# Altium schematic sheet Display-RTC.SchDoc
size 431 x 279 mm; SheetNumber: 2; SheetTotal: 2
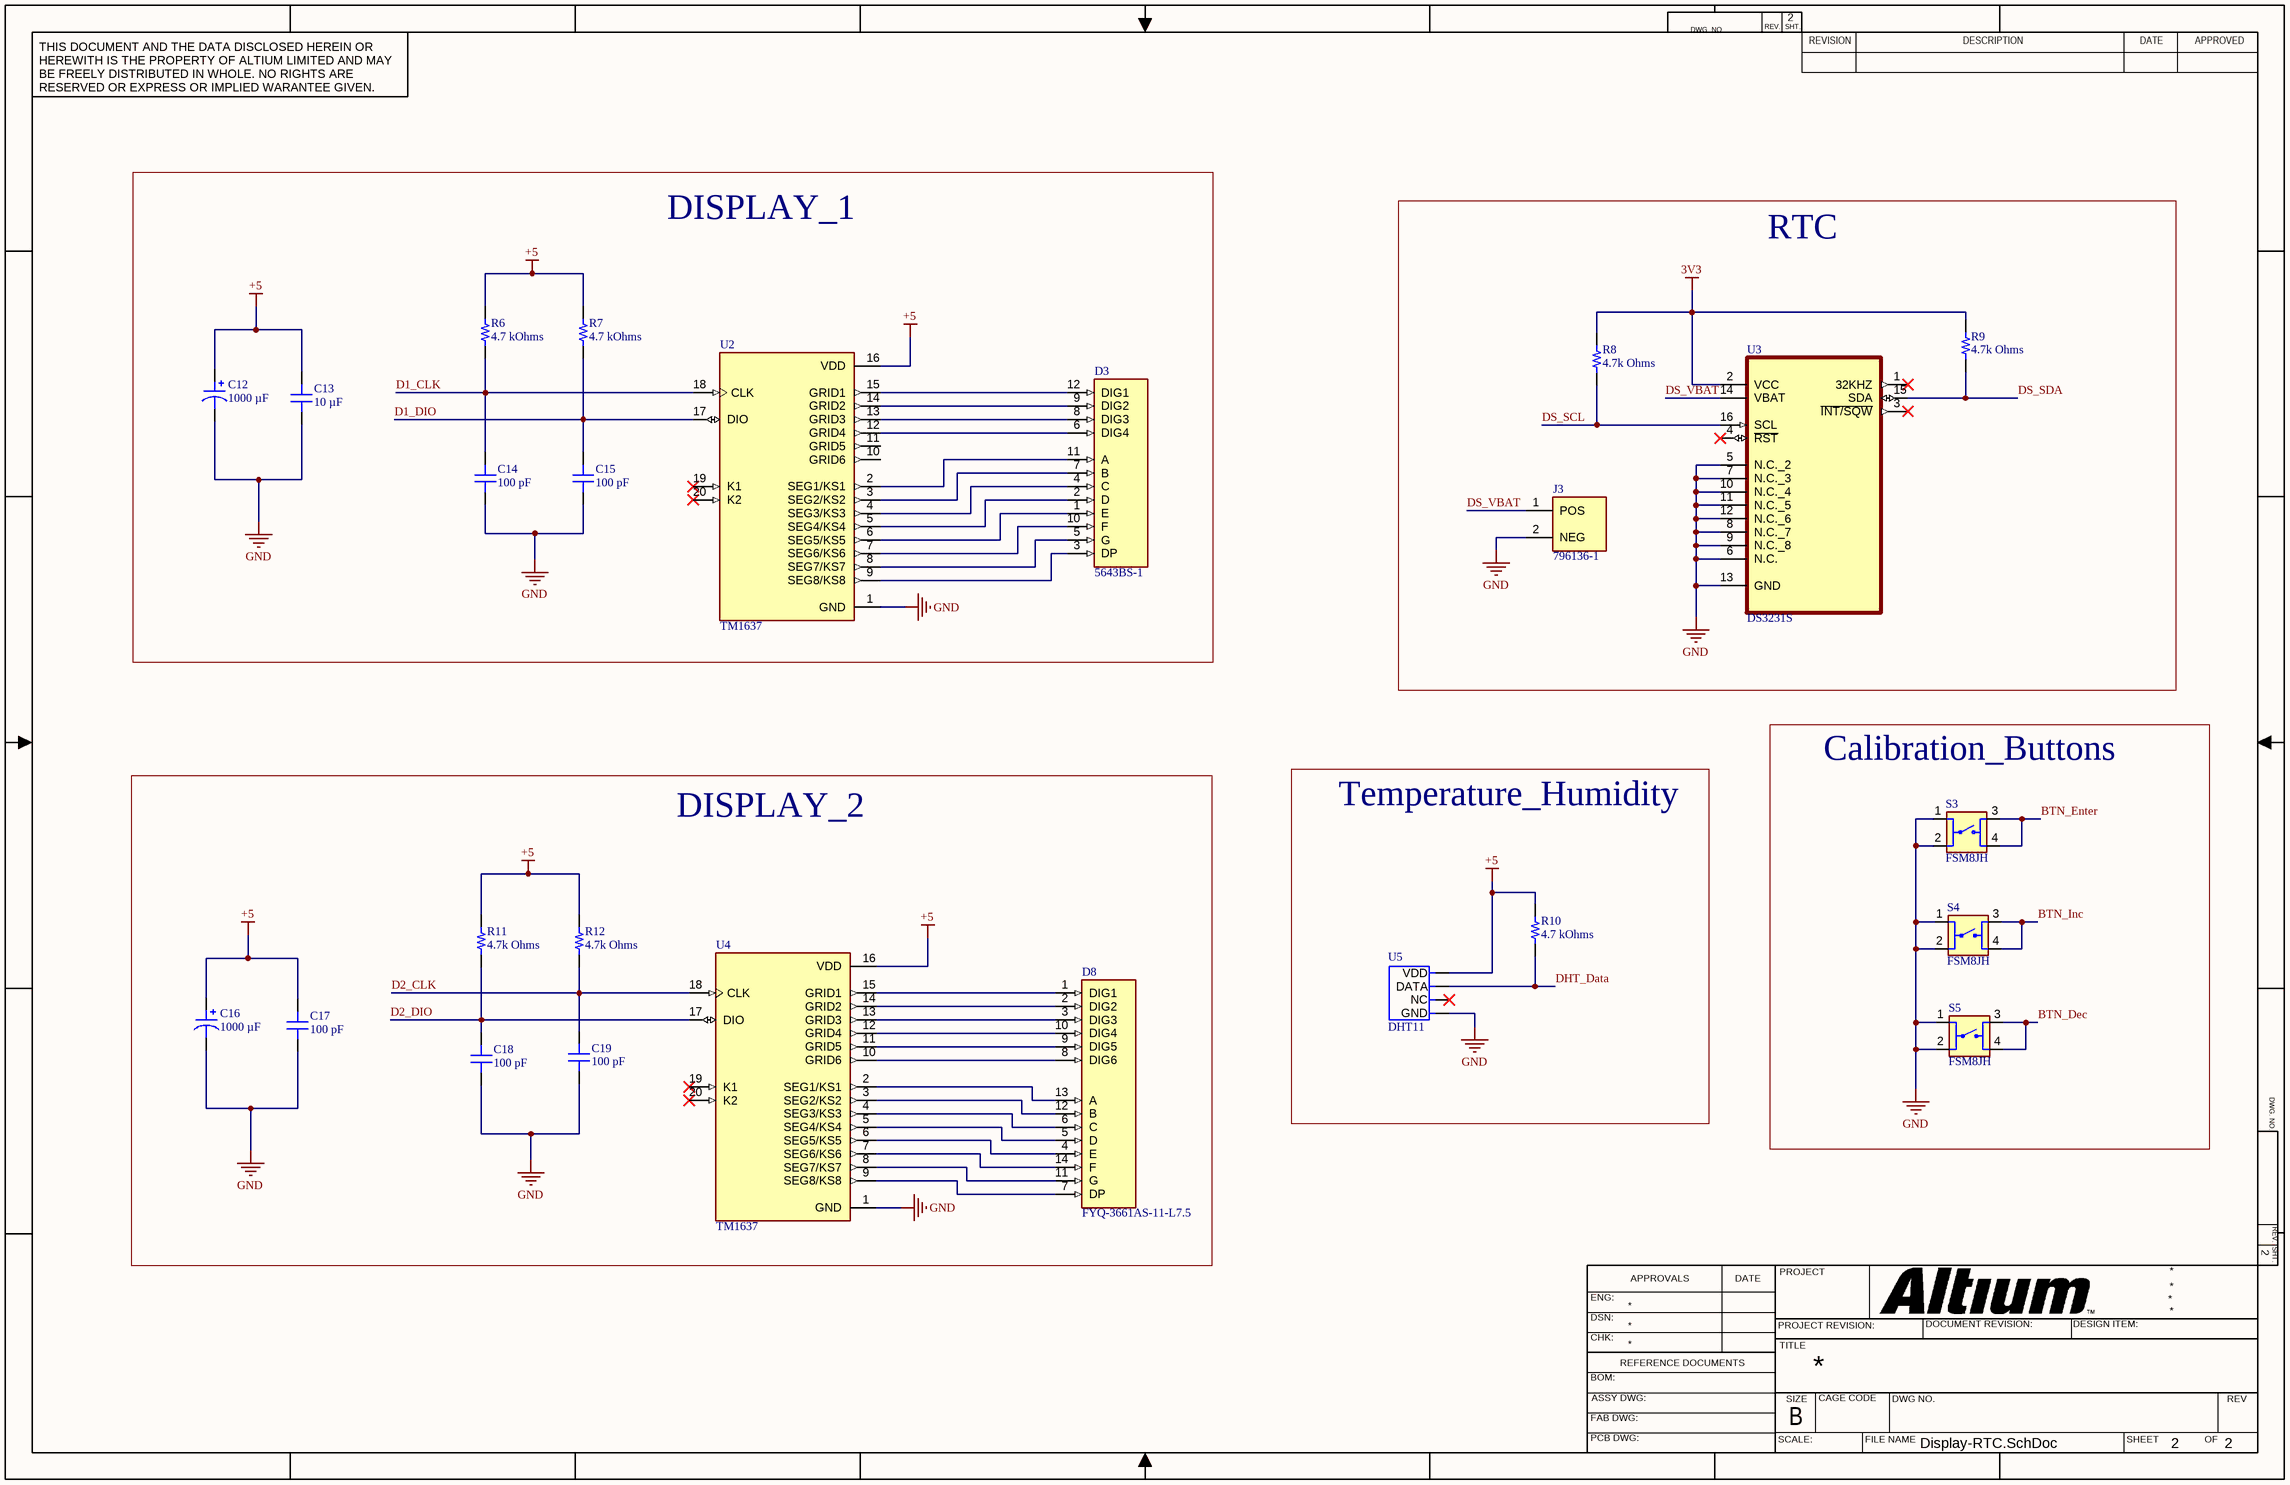
[diagram p0: Display-RTC.SchDoc]

## Parts
C12  1000 µF  [CAP AL TH D8 L3.5 H12.5]
C13  10 µF  [CAP 0402_1005]
C14  100 pF  [CAP 0402_1005]
C15  100 pF  [CAP 0402_1005]
C16  1000 µF  [CAP AL TH D8 L3.5 H12.5]
C17  100 pF  [CAP 0402_1005]
C18  100 pF  [CAP 0402_1005]
C19  100 pF  [CAP 0402_1005]
D3  5643BS-1  [5643BS-1]
D8  FYQ-3661AS-11-L7.5  [FYQ-3661AS-11-L7.5]
J3  796136-1  [TE_796136-1]
R6  4.7 kOhms  [RES 0805_2012]
R7  4.7 kOhms  [RES 0805_2012]
R8  value 4.7k Ohms  [RES 0805_2012]  (hidden comment: 4k7 Ohms)
R9  value 4.7k Ohms  [RES 0805_2012]  (hidden comment: 4k7 Ohms)
R10  4.7 kOhms  [RES 0805_2012]
R11  value 4.7k Ohms  [RES 0805_2012]  (hidden comment: 10k Ohms)
R12  value 4.7k Ohms  [RES 0805_2012]  (hidden comment: 10k Ohms)
S3  FSM8JH  [SW_FSM8JH]
S4  FSM8JH  [SW_FSM8JH]
S5  FSM8JH  [SW_FSM8JH]
U2  TM1637  [TM1637]
U3  DS3231S  [SOIC16]
U4  TM1637  [TM1637]
U5  DHT11  [DHT11]

## Blocks framed on the sheet
DISPLAY_1: C12-C15 D3 R6 R7 U2
RTC: J3 R8 R9 U3
Calibration_Buttons: S3-S5
DISPLAY_2: C16-C19 D8 R11 R12 U4
Temperature_Humidity: R10 U5

## Nets
3V3: R8.2 R9.2 U3.2(VCC)
+5: C12.1 C13.2 C16.1 C17.2 R6.2 R7.2 R10.2 R11.2 R12.2 U2.16(VDD) U4.16(VDD) U5.1(VDD)
GND: C12.2 C13.1 C14.1 C15.1 C16.2 C17.1 C18.1 C19.1 J3.2(NEG) S3.1 S3.2 S4.1 S4.2 S5.1 S5.2 U2.1(GND) U3.5(N.C._2) U3.6(N.C.) U3.7(N.C._3) U3.8(N.C._7) U3.9(N.C._8) U3.10(N.C._4) U3.11(N.C._5) U3.12(N.C._6) U3.13(GND) U4.1(GND) U5.4(GND)
BTN_Dec: S5.3 S5.4
BTN_Enter: S3.3 S3.4
BTN_Inc: S4.3 S4.4
D1_CLK: C14.2 R6.1 U2.18(CLK)
D1_DIO: C15.2 R7.1 U2.17(DIO)
D2_CLK: C19.2 R12.1 U4.18(CLK)
D2_DIO: C18.2 R11.1 U4.17(DIO)
DHT_Data: R10.1 U5.2(DATA)
DS_SCL: R8.1 U3.16(SCL)
DS_SDA: R9.1 U3.15(SDA)
DS_VBAT: J3.1(POS) U3.14(VBAT)
NetD3_1: D3.1(E) U2.6(SEG5/KS5)
NetD3_2: D3.2(D) U2.5(SEG4/KS4)
NetD3_3: D3.3(DP) U2.9(SEG8/KS8)
NetD3_4: D3.4(C) U2.4(SEG3/KS3)
NetD3_5: D3.5(G) U2.8(SEG7/KS7)
NetD3_6: D3.6(DIG4) U2.12(GRID4)
NetD3_7: D3.7(B) U2.3(SEG2/KS2)
NetD3_8: D3.8(DIG3) U2.13(GRID3)
NetD3_9: D3.9(DIG2) U2.14(GRID2)
NetD3_10: D3.10(F) U2.7(SEG6/KS6)
NetD3_11: D3.11(A) U2.2(SEG1/KS1)
NetD3_12: D3.12(DIG1) U2.15(GRID1)
NetD8_1: D8.1(DIG1) U4.15(GRID1)
NetD8_2: D8.2(DIG2) U4.14(GRID2)
NetD8_3: D8.3(DIG3) U4.13(GRID3)
NetD8_4: D8.4(E) U4.6(SEG5/KS5)
NetD8_5: D8.5(D) U4.5(SEG4/KS4)
NetD8_6: D8.6(C) U4.4(SEG3/KS3)
NetD8_7: D8.7(DP) U4.9(SEG8/KS8)
NetD8_8: D8.8(DIG6) U4.10(GRID6)
NetD8_9: D8.9(DIG5) U4.11(GRID5)
NetD8_10: D8.10(DIG4) U4.12(GRID4)
NetD8_11: D8.11(G) U4.8(SEG7/KS7)
NetD8_12: D8.12(B) U4.3(SEG2/KS2)
NetD8_13: D8.13(A) U4.2(SEG1/KS1)
NetD8_14: D8.14(F) U4.7(SEG6/KS6)

Not connected (* = marked no-connect by the designer): U2 10(GRID6) 11(GRID5) 19(K1)* 20(K2)*; U3 1(32KHZ)* 3(~{INT/SQW})* 4(~{RST})*; U4 19(K1)* 20(K2)*; U5 3(NC)*

## Notes on the sheet
- DWG. NO.
- REV.
- SHT.
- THIS DOCUMENT AND THE DATA DISCLOSED HEREIN OR HEREWITH IS THE PROPERTY OF ALTIUM LIMITED AND MAY BE FREELY DISTRIBUTED IN WHOLE. NO RIGHTS ARE RESERVED OR EXPRESS OR IMPLIED WARANTEE GIVEN.
- REVISION
- DESCRIPTION
- DATE
- APPROVED
- ENG:
- APPROVALS
- PROJECT
- DSN:
- CHK:
- REFERENCE DOCUMENTS
- PROJECT REVISION:
- TITLE
- DOCUMENT REVISION:
- DESIGN ITEM:
- BOM:
- FAB DWG:
- PCB DWG:
- ASSY DWG:
- SCALE:
- SIZE
- B
- CAGE CODE
- FILE NAME
- DWG NO.
- SHEET
- OF
- REV

## Library data of the parts
C12 C16 = ECA-0JHG102: CAP ALUM 1000UF 20% 6.3V RADIAL; manufacturer: Panasonic Electronic Components; Lifetime @ Temp.: 1000 Hrs @ 105°C; Polarization: Polar; Ripple Current @ High Frequency: 437 mA @ 100 kHz; Ripple Current @ Low Frequency: 380 mA @ 120 Hz; Part Number: ECA-0JHG102; Applications: General Purpose; Capacitance: 1000 µF; componentlink1description: Datasheet; componentlink1url: https://industrial.panasonic.com/cdbs/www-data/pdf/RDF0000/ABA0000C75.pdf; componentlink2description: DigiKey Link; componentlink2url: https://www.digikey.com/en/products/detail/panasonic-electronic-components/ECA-0JHG102/245108; Device Package: Radial, Can; Height - Seated (Max): 0.492" (12.50mm); lastupdated: 3.06.2024 20:06:12; Lead Spacing: 0.138" (3.50mm); Lifecycle Status: Active; Minimum Order: 1; Mounting Type: Through Hole; Operating Temperature: -55°C ~ 105°C; Package / Case: Radial, Can; packaging: Bulk; partid: 7190; Part Status: Active; price: 0.10; series: NHG-A; Size / Dimension: 0.315" Dia (8.00mm); Supplier 1: DigiKey; Supplier Part Number 1: P5509-ND; Tolerance: ±20%; value: 1000 µF; Voltage - Rated: 6.3 V
C13 = CL05A106MP8NUB8: CAP CER 10UF 10V X5R 0402; manufacturer: Samsung Electro-Mechanics; Tolerance: ±20%; Part Number: CL05A106MP8NUB8; Capacitance: 10 µF; Applications: Acoustic Noise Reduction; componentlink1description: Datasheet; componentlink1url: http://www.samsungsem.com/kr/support/product-search/mlcc/CL05A106MP8NUB8.jsp; componentlink2description: DigiKey Link; componentlink2url: https://www.digikey.com/en/products/detail/samsung-electro-mechanics/CL05A106MP8NUB8/5961314; Device Package: 0402 (1005 Metric); lastupdated: 9.02.2024 20:04:38; Lifecycle Status: Active; Minimum Order: 1; Mounting Type: Surface Mount, MLCC; Operating Temperature: -55°C ~ 85°C; Package / Case: 0402 (1005 Metric); packaging: TapeAndReel; partid: 1758; Part Status: Active; price: 0.06; series: CL; Size / Dimension: 0.039" L x 0.020" W (1.00mm x 0.50mm); Supplier 1: DigiKey; Supplier Part Number 1: 1276-6830-1-ND; Temperature Coefficient: X5R; Thickness (Max): 0.035" (0.90mm); value: 10 µF; Voltage - Rated: 10V
C14 C15 C17-C19 = 500X07N101MV4T: CAP CER 100PF 50V C0G/NP0 0402; manufacturer: Johanson Dielectrics Inc.; Temperature Coefficient: C0G, NP0; Tolerance: ±20%; Part Number: 500X07N101MV4T; Capacitance: 100 pF; Applications: Bypass, Decoupling; componentlink1description: Datasheet; componentlink1url: https://www.johansondielectrics.com/downloads/x2y-filter-and-decoupling-capacitors.pdf; componentlink2description: DigiKey Link; componentlink2url: https://www.digikey.com/en/products/detail/johanson-dielectrics-inc/500X07N101MV4T/2046917; Device Package: 0402 (1005 Metric); Features: Low ESL (X2Y); lastupdated: 9.02.2024 20:04:38; Lifecycle Status: Active; Minimum Order: 1; Mounting Type: Surface Mount, MLCC; Operating Temperature: -55°C ~ 125°C; Package / Case: 0402 (1005 Metric); packaging: TapeAndReel; partid: 1767; Part Status: Active; price: 0.08; series: X2Y®; Size / Dimension: 0.045" L x 0.025" W (1.14mm x 0.64mm); Supplier 1: DigiKey; Supplier Part Number 1: 709-1214-1-ND; Thickness (Max): 0.020" (0.51mm); value: 100 pF; Voltage - Rated: 50V
J3 = 796136-1: BATTERY HOLDER COIN 20MM SMD; Package: None; MP: 796136-1; Value: *; Availability: Unavailable; Price: None
R6 R7 R10 = CRGH0805F4K7: CRGH0805 1% 4K7 0.33W; Manufacturer: TE Connectivity Passive Product; Power (Watts): 0.333W, 1/3W; Temperature Coefficient: ±100ppm/°C; Part Number: CRGH0805F4K7; Value: 4.7 kOhms; ComponentLink1Description: Datasheet; ComponentLink1URL: https://www.te.com/commerce/DocumentDelivery/DDEController?Action=srchrtrv&DocNm=1773204-1&DocType=DS&DocLang=English; ComponentLink2Description: DigiKey Link; ComponentLink2URL: https://www.digikey.com/en/products/detail/te-connectivity-passive-product/CRGH0805F4K7/7495027; Composition: Thick Film; Device Package: 0805 (2012 Metric); Height - Seated (Max): 0.026" (0.65mm); LastUpdated: 8.02.2024 21:01:27; Lifecycle Status: Active; Minimum Order: 1; Number of Terminations: 2; Operating Temperature: -55°C ~ 155°C; Package / Case: 0805 (2012 Metric); Packaging: TapeAndReel; PartId: 44424; Part Status: Active; Price: 0.01; Resistance: 4.7 kOhms; Series: CRGH, Neohm; Size / Dimension: 0.079" L x 0.049" W (2.00mm x 1.25mm); Supplier 1: DigiKey; Supplier Part Number 1: A129546CT-ND; Supplier Device Package: 0805; Tolerance: ±1%
R8 R9 R11 R12 = TLRZ2ATTD: RES 0 OHM JUMPER 0805; Manufacturer: KOA Speer Electronics, Inc.; Resistance: 0 Ohms; Part Number: TLRZ2ATTD; ComponentLink1Description: Datasheet; ComponentLink1URL: http://www.koaspeer.com/catimages/Products/TLRZ/TLRZ.pdf; ComponentLink2Description: DigiKey Link; ComponentLink2URL: https://www.digikey.com/en/products/detail/koa-speer-electronics-inc/TLRZ2ATTD/9845494; Composition: Metal Element; Device Package: 0805 (2012 Metric); Features: Automotive AEC-Q200, Current Sense; Height - Seated (Max): 0.022" (0.55mm); LastUpdated: 8.02.2024 21:02:39; Lifecycle Status: Active; Minimum Order: 1; Number of Terminations: 2; Operating Temperature: -55°C ~ 170°C; Package / Case: 0805 (2012 Metric); Packaging: TapeAndReel; PartId: 27685; Part Status: Active; Price: 0.08; Ratings: AEC-Q200; Series: TLRZ; Size / Dimension: 0.079" L x 0.049" W (2.00mm x 1.25mm); Supplier 1: DigiKey; Supplier Part Number 1: 2019-TLRZ2ATTDCT-ND; Supplier Device Package: 0805; Tolerance: Jumper
S3-S5 = FSM8JH: Tactile Switch SPST-NO Top Actuated Through Hole; MF: TE Connectivity; Check_prices: https://www.snapeda.com/parts/FSM8JH/TE+Connectivity+ALCOSWITCH+Switches/view-part/?ref=eda; Value: *; Availability: In Stock; MP: FSM8JH; Price: None; Package: None; SnapEDA_Link: https://www.snapeda.com/parts/FSM8JH/TE+Connectivity+ALCOSWITCH+Switches/view-part/?ref=snap
U2 U4 = TM1637: LED Drive Control Special Circuit; MF: Titan Micro Electronics; SnapEDA_Link: https://www.snapeda.com/parts/TM1637/Titan+Micro+Electronics/view-part/?ref=snap; Package: None; Value: *; MP: TM1637; Check_prices: https://www.snapeda.com/parts/TM1637/Titan+Micro+Electronics/view-part/?ref=eda
U3 = DS3231S: Real Time Clock (RTC) IC Clock/Calendar - IÂ²C, 2-Wire Serial 16-SOIC (0.295, 7.50mm Width); MF: Maxim Integrated; MP: DS3231S#; Value: *; Price: None; Package: SOIC-16 Maxim; Check_prices: https://www.snapeda.com/parts/DS3231S%23/Maxim+Integrated/view-part/?ref=eda; Availability: In Stock; SnapEDA_Link: https://www.snapeda.com/parts/DS3231S%23/Maxim+Integrated/view-part/?ref=snap; Purchase-URL: https://pricing.snapeda.com/search/part/DS3231S#/?ref=eda
U5 = DHT11: Servo AC 100 ~ 120VAC Supply 10A 120V Load; MF: Panasonic Industrial Automation Sales; MP: DHT11; Package: None; SnapEDA_Link: https://www.snapeda.com/parts/DHT11/Panasonic/view-part/6618018/?ref=snap; Check_prices: https://www.snapeda.com/parts/DHT11/Panasonic/view-part/6618018/?ref=eda; Availability: In Stock; Value: *; Price: None; Purchase-URL: https://pricing.snapeda.com/search/part/DHT11/?ref=eda